# Altium project PuttPilot-Dev.PrjPcb (part 3 of 4)

## Sheet USB_TO_UART.SchDoc: USB to UART
size 279 x 215 mm; DrawnBy: Ethan Abraham; Engineer: Ethan Abraham; Revision: 1.0; SheetNumber: 6; SheetTotal: 7
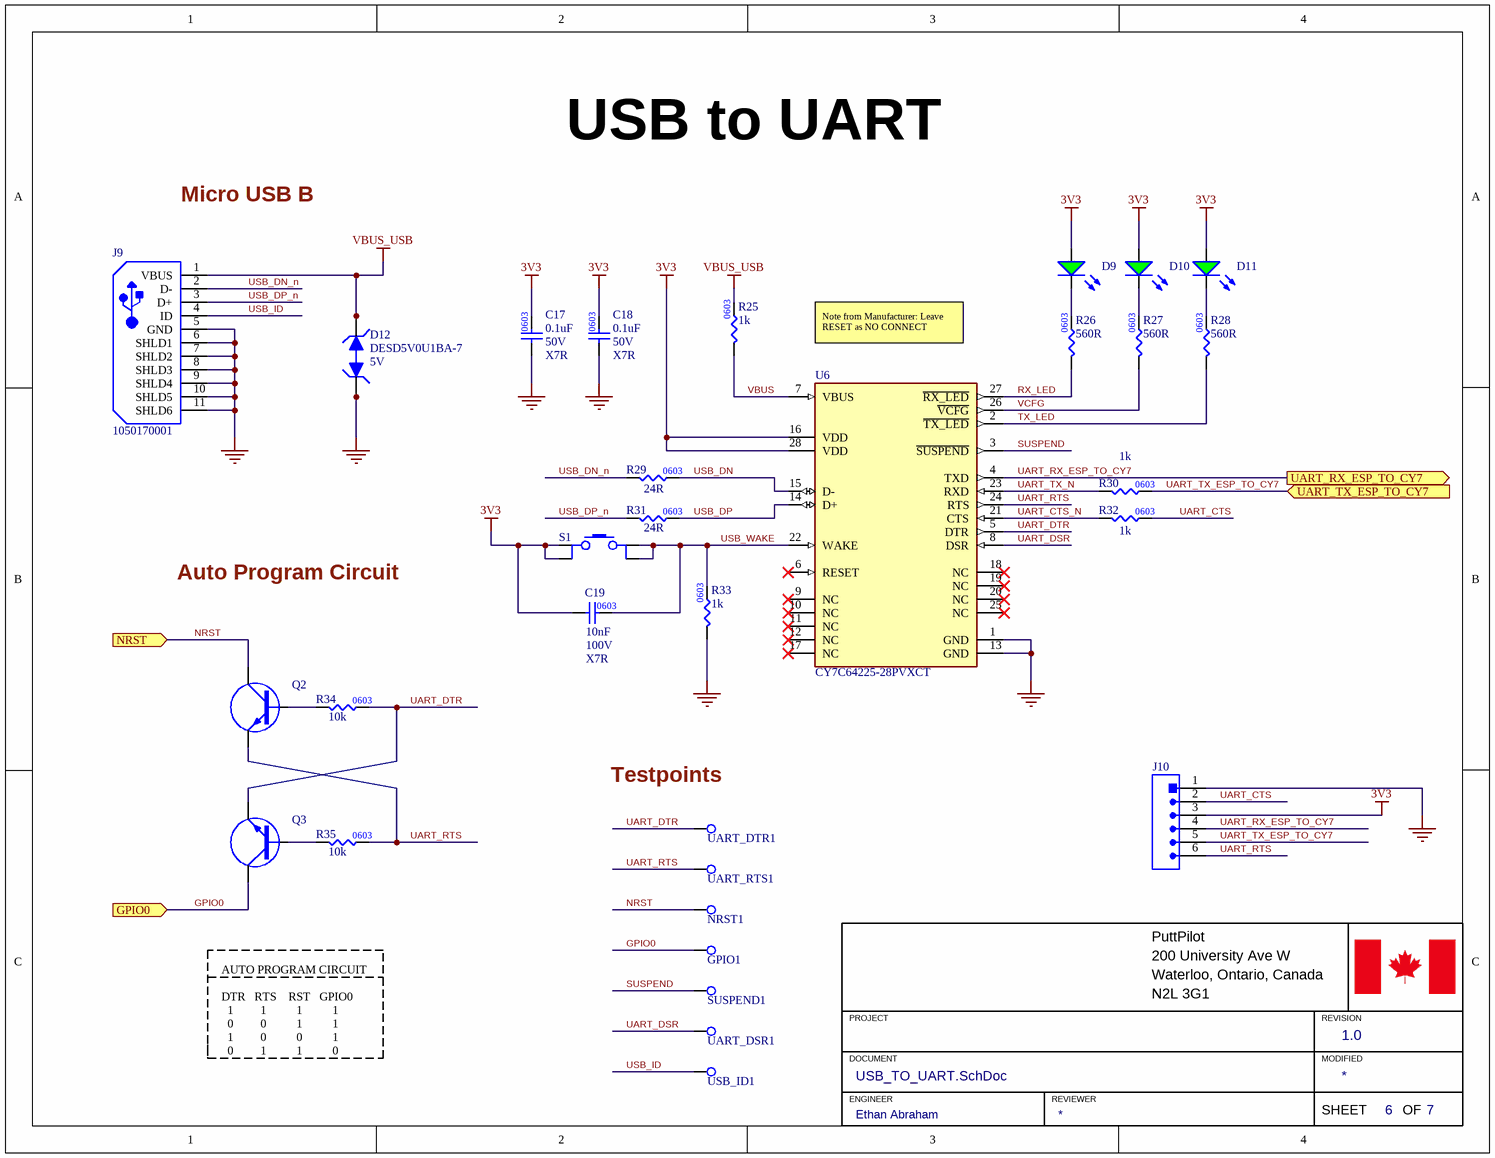
[diagram p5: USB_TO_UART.SchDoc]

### Parts
C17  Temperature Characteristics Code: X7R  Rated DC Voltage (URdc): 50V  Capacitance: 0.1uF  [.CAP_0603]  (hidden comment: GCJ188R71H104KA12D)
C18  Temperature Characteristics Code: X7R  Rated DC Voltage (URdc): 50V  Capacitance: 0.1uF  [.CAP_0603]  (hidden comment: GCJ188R71H104KA12D)
C19  Dielectric: X7R  Voltage Rating: 100V  Capacitance: 10nF  [.CAP_0603]  (hidden comment: GCM188R72A103KA37D)
D9  LTST-C191KGKT  [.LED_0603]  (value not drawn)
D10  LTST-C191KGKT  [.LED_0603]  (value not drawn)
D11  LTST-C191KGKT  [.LED_0603]  (value not drawn)
D12  DESD5V0U1BA-7  Rep Pk Reverse Voltage-Max: 5V  [DESD5V0U1BA-7]
GPIO1  RCWCTE  [RCWCTE]  (value not drawn)
J9  1050170001  [USB_MICRO_B]
J10  PRPC040SAAN-RC_POS6  [HEADER_6POS_2.54MM]  (value not drawn)
NRST1  RCWCTE  [RCWCTE]  (value not drawn)
Q2  MMBT2222A-7-F  [.SOT-23-3]  (value not drawn)
Q3  MMBT2222A-7-F  [.SOT-23-3]  (value not drawn)
R25  Resistance: 1k  [.RES_0603]  (hidden comment: RC0603FR-071KL)
R26  Resistance: 560R  [.RES_0603]  (hidden comment: RC0603FR-07560RL)
R27  Resistance: 560R  [.RES_0603]  (hidden comment: RC0603FR-07560RL)
R28  Resistance: 560R  [.RES_0603]  (hidden comment: RC0603FR-07560RL)
R29  Resistance: 24R  [.RES_0603]  (hidden comment: RC0603FR-0724RL)
R30  Resistance: 1k  [.RES_0603]  (hidden comment: RC0603FR-071KL)
R31  Resistance: 24R  [.RES_0603]  (hidden comment: RC0603FR-0724RL)
R32  Resistance: 1k  [.RES_0603]  (hidden comment: RC0603FR-071KL)
R33  Resistance: 1k  [.RES_0603]  (hidden comment: RC0603FR-071KL)
R34  Resistance: 10k  [.RES_0603]  (hidden comment: RC0603FR-0710KL)
R35  Resistance: 10k  [.RES_0603]  (hidden comment: RC0603FR-0710KL)
S1  PTS647SN38SMTR2LFS  [PTS647SN38SMTR2LFS]  (value not drawn)
SUSPEND1  RCWCTE  [RCWCTE]  (value not drawn)
U6  CY7C64225-28PVXCT  [CY7C64225-28PVXCT]
UART_DSR1  RCWCTE  [RCWCTE]  (value not drawn)
UART_DTR1  RCWCTE  [RCWCTE]  (value not drawn)
UART_RTS1  RCWCTE  [RCWCTE]  (value not drawn)
USB_ID1  RCWCTE  [RCWCTE]  (value not drawn)

### Ports
GPIO0 (in), NRST (in), UART_RX_ESP_TO_CY7 (out), UART_TX_ESP_TO_CY7 (in)

### Nets
3V3: C17.2 C18.2 C19.1 D9.1(A) D10.1(A) D11.1(A) J10.3 S1.1 S1.2 U6.16(VDD) U6.28(VDD)
GND: C17.1 C18.1 D12.1(Pin_1) J9.5(GND) J9.6(SHLD1) J9.7(SHLD2) J9.8(SHLD3) J9.9(SHLD4) J9.10(SHLD5) J9.11(SHLD6) J10.1 R33.1 U6.1(GND) U6.13(GND)
VBUS_USB: D12.2(Pin_2) J9.1(VBUS) R25.2
GPIO0: GPIO1.1 Q3.2(Emitter) ; port GPIO0
NRST: NRST1.1 Q2.2(Emitter) ; port NRST
RX_LED: R26.1 U6.27(~{RX_LED})
SUSPEND: SUSPEND1.1 U6.3(~{SUSPEND})
TX_LED: R28.1 U6.2(~{TX_LED})
UART_CTS: J10.2 R32.2
UART_CTS_N: R32.1 U6.21(CTS)
UART_DSR: U6.8(DSR) UART_DSR1.1
UART_DTR: Q3.3(Collector) R34.2 U6.5(DTR) UART_DTR1.1
UART_RTS: J10.6 Q2.3(Collector) R35.2 U6.24(RTS) UART_RTS1.1
UART_RX_ESP_TO_CY7: J10.4 U6.4(TXD) ; port UART_RX_ESP_TO_CY7
UART_TX_ESP_TO_CY7: J10.5 R30.2 ; port UART_TX_ESP_TO_CY7
UART_TX_N: R30.1 U6.23(RXD)
USB_DN: R29.2 U6.15(D-)
USB_DN_n: J9.2(D-) R29.1
USB_DP: R31.2 U6.14(D+)
USB_DP_n: J9.3(D+) R31.1
USB_ID: J9.4(ID) USB_ID1.1
USB_WAKE: C19.2 R33.2 S1.3 S1.4 U6.22(WAKE)
VBUS: R25.1 U6.7(VBUS)
VCFG: R27.1 U6.26(~{VCFG})
NetD9_2: D9.2(K) R26.2
NetD10_2: D10.2(K) R27.2
NetD11_2: D11.2(K) R28.2
NetQ2_1: Q2.1(Base) R34.1
NetQ3_1: Q3.1(Base) R35.1

Not connected (* = marked no-connect by the designer): U6 6(RESET)* 9(NC)* 10(NC)* 11(NC)* 12(NC)* 17(NC)* 18(NC)* 19(NC)* 20(NC)* 25(NC)*

### Notes on the sheet
- Micro USB B
- Note from Manufacturer: Leave RESET as NO CONNECT
- Auto Program Circuit
- (near UART_DTR1) Testpoints
- AUTO PROGRAM CIRCUIT
  DTR   RTS    RST   GPIO0
  1         1          1          1
  0         0          1          1
  1         0          0          1
  0         1          1          0
- PuttPilot
- 200 University Ave W
- PROJECT
- Waterloo, Ontario, Canada
- N2L 3G1
- REVISION
- DOCUMENT
- ENGINEER
- REVIEWER
- MODIFIED
- SHEET
- OF

### Library data of the parts
C17 C18 = GCJ188R71H104KA12D: CAP CER 0.1uF 50V X7R 0603; Manufacturer: Murata; Dielectric Material: Ceramic; Multilayer: Yes; Negative Tolerance: 10%; Reference Standard: AEC-Q200; Supplier 1: Future Electronics; Manufacturer Part Number: GCJ188R71H104KA12D; RoHS: Yes; Category: Ceramic Capacitors; Stock 1: 3280000; Pricing 1: 4000=0.0182, 12000=0.0178, 20000=0.0176, 80000=0.017, 120000=0.0167 (USD); Mount: Surface Mount; Number of Pins: 2; Package Shape: Rectangular; Size Code: 0603; Terminal Finish: Nickel; Min Operating Temperature: -55°C; Max Operating Temperature: 125°C; JESD-609 Code: e3; Capacitor Type: Ceramic; Package Style: SMTMeter; Packaging: Tape and Reel; Positive Tolerance: 10%; Termination: Wraparound; Length: 1.6mm; Width: 0.8mm; Height: 0.8mm; Reach SVHC Compliant: Yes; RoHS Compliant: Yes; ComponentLink1URL: https://psearch.en.murata.com:443/capacitor/product/GCJ188R71H104KA12%23.pdf?src-supplier=IHS+Markit; ComponentLink1Description: https://psearch.en.murata.com:443/capacitor/product/GCJ188R71H104KA12%23.pdf?src-supplier=IHS+Markit; ComponentLink2URL: https://datasheet.ciiva.com/135/product-135604.pdf?src-supplier=Digikey; ComponentLink2Description: https://datasheet.ciiva.com/135/product-135604.pdf?src-supplier=Digikey; ComponentLink3URL: https://datasheet.ciiva.com/26889/getdatasheetpartid-369886-26889118.pdf?src-supplier=Verical; ComponentLink3Description: https://datasheet.ciiva.com/26889/getdatasheetpartid-369886-26889118.pdf?src-supplier=Verical; ComponentLink4URL: https://datasheet.ciiva.com/135/s0717e-135605.pdf?src-supplier=Digikey; ComponentLink4Description: https://datasheet.ciiva.com/135/s0717e-135605.pdf?src-supplier=Digikey; ComponentLink5URL: https://datasheet.ciiva.com/135/s0717e-135606.pdf?src-supplier=Digikey; ComponentLink5Description: https://datasheet.ciiva.com/135/s0717e-135606.pdf?src-supplier=Digikey; ComponentLink6URL: https://datasheet.ciiva.com/16440/c03e-16440425.pdf?src-supplier=Future+Electronics; ComponentLink6Description: https://datasheet.ciiva.com/16440/c03e-16440425.pdf?src-supplier=Future+Electronics; Supplier Part Number 1: 1158604
C19 = GCM188R72A103KA37D: CAP CER 0.01uF 100V X7R; Manufacturer: Murata; Material: Ceramic; Tolerance: 10%; Supplier 1: Future Electronics; Manufacturer Part Number: GCM188R72A103KA37D; RoHS: Yes; Category: Ceramic Capacitors; Stock 1: 4568000; Pricing 1: 4000=0.0077, 16000=0.0074, 60000=0.0071, 100000=0.007, 200000=0.0068 (USD); Mount: Surface Mount; Case/Package: 0603; Case Code (Imperial): 0603; Case Code (Metric): 1608; Min Operating Temperature: -55°C; Max Operating Temperature: 125°C; Packaging: Tape and Reel; Voltage Rating (DC): 100V; Package Quantity: 1; Termination: SMD/SMT; Voltage: 100V; Series: GCM; Construction: Flat; Length: 1.6mm; Width: 0.031inch; Height: 0.8mm; Thickness: 0.035inch; Depth: 0.8mm; Ratings: AEC-Q200; Radiation Hardening: No; Reach SVHC Compliant: No; Lead Free: Lead Free; RoHS Compliant: Yes; ComponentLink1URL: https://datasheet.ciiva.com/132/product-132907.pdf?src-supplier=Digikey; ComponentLink1Description: https://datasheet.ciiva.com/132/product-132907.pdf?src-supplier=Digikey; ComponentLink2URL: https://datasheet.ciiva.com/132/product-132908.pdf?src-supplier=Digikey; ComponentLink2Description: https://datasheet.ciiva.com/132/product-132908.pdf?src-supplier=Digikey; ComponentLink3URL: https://datasheet.ciiva.com/132/product-132909.pdf?src-supplier=Digikey; ComponentLink3Description: https://datasheet.ciiva.com/132/product-132909.pdf?src-supplier=Digikey; ComponentLink4URL: https://datasheet.ciiva.com/16497/product-16497251.pdf?src-supplier=Future+Electronics; ComponentLink4Description: https://datasheet.ciiva.com/16497/product-16497251.pdf?src-supplier=Future+Electronics; ComponentLink5URL: https://datasheet.ciiva.com/18183/getdatasheetpartid-178890-18183651.pdf?src-supplier=Verical; ComponentLink5Description: https://datasheet.ciiva.com/18183/getdatasheetpartid-178890-18183651.pdf?src-supplier=Verical; ComponentLink6URL: https://datasheet.ciiva.com/11786/0900766b80ef92d0-11786108.pdf?src-supplier=Rs; ComponentLink6Description: https://datasheet.ciiva.com/11786/0900766b80ef92d0-11786108.pdf?src-supplier=Rs; ComponentLink7URL: https://datasheet.ciiva.com/11619/product-11619719.pdf?src-supplier=Avnet; ComponentLink7Description: https://datasheet.ciiva.com/11619/product-11619719.pdf?src-supplier=Avnet; Supplier Part Number 1: 5029232
D9-D11 = LTST-C191KGKT: LED GREEN 2V 0603; Manufacturer: Vishay Lite-On; Shape: Rectangular; Lens Style: WATER CLEAR; Forward Current-Max: 30mA; Luminous Intensity-Nom: 35mcd; Number of Functions: 1; Optoelectronic Device Type: SINGLE COLOR LED; Viewing Angle: 130°; Forward Voltage-Max: 2.4V; Reverse Voltage-Max: 5V; Overall Height: 0.55mm; Supplier 1: Digikey; Manufacturer Part Number: LTST-C191KGKT; RoHS: Yes; Stock 1: 171853; Pricing 1: 1=0.22, 10=0.121, 100=0.0721, 500=0.05324, 1000=0.04748, 2000=0.04278 (USD); Mount: Surface Mount; Number of Pins: 2; Color: Green; Color@wavelength: Green; Terminal Finish: Tin; Min Operating Temperature: -55°C; Max Operating Temperature: 85°C; Packaging: Tape and Reel; JESD-609 Code: e3; Size: 1.1mm; Terminal Pitch: 1.5mm; Reach SVHC Compliant: Yes; RoHS Compliant: Yes; ComponentLink1URL: https://datasheet.ciiva.com:443/pdfs/VipMasterIC/IC/LITE/LITE-S-A0003156116/LITE-S-A0003156116-1.pdf?src-supplier=IHS+Markit; ComponentLink1Description: https://datasheet.ciiva.com:443/pdfs/VipMasterIC/IC/LITE/LITE-S-A0003156116/LITE-S-A0003156116-1.pdf?src-supplier=IHS+Markit; ComponentLink2URL: https://datasheet.ciiva.com/2109/ltst-c191kgkt-2109973.pdf?src-supplier=Digikey; ComponentLink2Description: https://datasheet.ciiva.com/2109/ltst-c191kgkt-2109973.pdf?src-supplier=Digikey; Supplier Part Number 1: 160-1446-1-ND
D12 = DESD5V0U1BA-7: TVS DIODE 5VWM; Manufacturer: Diodes; Diode Element Material: SILICON; Package Body Material: Plastic; Polarity: Bidirectional; Max Breakdown Voltage: 9.5V; Min Breakdown Voltage: 5.5V; Diode Type: TRANS VOLTAGE SUPPRESSOR; Number of Elements: 1; Max Power Dissipation: 250mW; Reference Standard: IEC-61000-4-2; Supplier 1: Future Electronics; Manufacturer Part Number: DESD5V0U1BA-7; RoHS: Yes; Category: TVS Diodes; Stock 1: 54000; Pricing 1: 3000=0.0283, 12000=0.0271, 30000=0.0263, 75000=0.0256, 120000=0.0244 (USD); Number of Pins: 2; Package Shape: Rectangular; Min Operating Temperature: -65°C; Max Operating Temperature: 150°C; JESD-30 Code: R-PDSO-G2; Package Style: SMALL OUTLINEMeter; Surface Mount: Yes; Technology: AVALANCHE; Terminal Form: Gull Wing; Terminal Position: DUAL; Reach SVHC Compliant: Yes; RoHS Compliant: Yes; ComponentLink1URL: https://datasheet.ciiva.com:443/pdfs/VipMasterIC/IC/DIOD/DIOD-S-A0002833665/DIOD-S-A0002833261-1.pdf?src-supplier=IHS+Markit; ComponentLink1Description: https://datasheet.ciiva.com:443/pdfs/VipMasterIC/IC/DIOD/DIOD-S-A0002833665/DIOD-S-A0002833261-1.pdf?src-supplier=IHS+Markit; ComponentLink2URL: http://www.farnell.com/datasheets/2814368.pdf?src-supplier=Farnell; ComponentLink2Description: http://www.farnell.com/datasheets/2814368.pdf?src-supplier=Farnell; ComponentLink3URL: http://www.mouser.com/ds/2/115/DESD5V0U1BA-756900.pdf?src-supplier=Mouser; ComponentLink3Description: http://www.mouser.com/ds/2/115/DESD5V0U1BA-756900.pdf?src-supplier=Mouser; ComponentLink4URL: http://www.farnell.com/datasheets/2814368.pdf?src-supplier=Element14; ComponentLink4Description: http://www.farnell.com/datasheets/2814368.pdf?src-supplier=Element14; ComponentLink5URL: http://www.farnell.com/datasheets/2814368.pdf?src-supplier=Newark; ComponentLink5Description: http://www.farnell.com/datasheets/2814368.pdf?src-supplier=Newark; ComponentLink6URL: https://www.diodes.com/assets/Datasheets/DESD5V0U1BA.pdf?src-supplier=Digikey; ComponentLink6Description: https://www.diodes.com/assets/Datasheets/DESD5V0U1BA.pdf?src-supplier=Digikey; Supplier Part Number 1: 8076210
GPIO1 NRST1 SUSPEND1 UART_DSR1 UART_DTR1 UART_RTS1 USB_ID1 = RCWCTE: SMT Test Point; Manufacturer: KOA Speer; Resistance: 0R; Current Rating: 2A; Number of Contacts: 1; Supplier 1: Digikey; Manufacturer Part Number: RCWCTE; RoHS: Yes; Category: Chip SMD Resistors; Stock 1: 56953; Pricing 1: 1=0.2, 10=0.15, 25=0.1344, 50=0.1238, 100=0.1141, 250=0.10268, 500=0.09488, 1000=0.08781 (USD); Mount: Surface Mount; Case/Package: 1206; Case Code (Imperial): 1206; Case Code (Metric): 3216; Contact Material: Copper,Tin; Min Operating Temperature: -55°C; Max Operating Temperature: 125°C; Packaging: Tape and Reel; Termination: SMD/SMT; Series: RC; Length: 3.2mm; Width: 1.6mm; Height: 2mm; Depth: 1.6mm; Military Standard: Not; RoHS Compliant: Yes; ComponentLink1URL: https://datasheet.ciiva.com/34302/1876186-34302940.pdf?src-supplier=Jameco; ComponentLink1Description: https://datasheet.ciiva.com/34302/1876186-34302940.pdf?src-supplier=Jameco; ComponentLink2URL: https://datasheet.ciiva.com/5556/rc-5556236.pdf?src-supplier=Mouser; ComponentLink2Description: https://datasheet.ciiva.com/5556/rc-5556236.pdf?src-supplier=Mouser; ComponentLink3URL: https://datasheet.ciiva.com/26821/getdatasheetpartid-110197-26821157.pdf?src-supplier=Verical; ComponentLink3Description: https://datasheet.ciiva.com/26821/getdatasheetpartid-110197-26821157.pdf?src-supplier=Verical; Supplier Part Number 1: 2019-RCWCTECT-ND
J9 = 1050170001: CONN USB MICRO B R/A; Manufacturer: Molex; Connector Type: TELECOM AND DATACOM CONNECTOR; Option: General Purpose; Additional Feature: Shielded; Board Mounting Option: PEG; Body/Shell Style: RECEPTACLE; Contact Resistance: 30mR; Dielectric Withstanding Voltage (AC): 100V; Durability: 10000Cycles; Empty Shell: No; Insulation Resistance: 1GR; Number Of Connectors: 1; PCB Contact Pattern: RECTANGULAR; Polarization Key: POLARIZED HOUSING; Rated Current (Signal): 1.8A; Number of Contacts: 5; Body Breadth: 0.114inch; Body Depth: 0.213inch; Body Length: 0.315inch; Mounting Option 1: DETENT; Mounting Option 2: LOCKING; Reference Standard: UL; Reliability: COMMERCIAL; Supplier 1: Avnet; Manufacturer Part Number: 1050170001; RoHS: Yes; Category: USB Connectors; Stock 1: 6195; Pricing 1: 1=1.14, 25=0.962, 100=0.813, 250=0.812, 1000=0.663 (USD); Mount: Cable; Contact Material: Copper Alloy; Contact Finish - Mating: GOLD; Contact Finish - Termination: Gold (Au) - with Nickel (Ni) barrier; Insulation Material: Polymer; Shell Finish: Tin; Shell Material: Stainless Steel; Min Operating Temperature: -30°C; Max Operating Temperature: 85°C; JESD-609 Code: e4; Contact Gender: Female; Contact Style: USB; Filter Feature: No; Mixed Contacts: No; Mounting Style: RIGHT ANGLE; Number Of PCB Rows: 1; Termination: SMD/SMT; Terminal Pitch: 0.635mm; Reach SVHC Compliant: Yes; RoHS Compliant: Yes; DIN Conformance: No; IEC Conformance: No; MIL Conformance: No; ComponentLink1URL: https://datasheet.ciiva.com:443/pdfs/VipMasterIC/IC/MOLE/MOLE-S-A0006795785/MOLE-S-A0006864883-1.pdf?src-supplier=IHS+Markit; ComponentLink1Description: https://datasheet.ciiva.com:443/pdfs/VipMasterIC/IC/MOLE/MOLE-S-A0006795785/MOLE-S-A0006864883-1.pdf?src-supplier=IHS+Markit; ComponentLink2URL: https://datasheet.ciiva.com/30165/235271050170001-io-nectors-30165183.pdf?src-supplier=Onlinecomponents.com; ComponentLink2Description: https://datasheet.ciiva.com/30165/235271050170001-io-nectors-30165183.pdf?src-supplier=Onlinecomponents.com; ComponentLink3URL: https://datasheet.ciiva.com/5742/1598502-5742508.pdf?src-supplier=Farnell; ComponentLink3Description: https://datasheet.ciiva.com/5742/1598502-5742508.pdf?src-supplier=Farnell; Supplier Part Number 1: 78R1699
J10 = PRPC040SAAN-RC_POS6: CONN HEADER VERT 6POS 2.54MM
Q2 Q3 = MMBT2222A-7-F: NPN BJT 40V 600mA SOT-23; Manufacturer: Diodes; Package Body Material: Plastic; Transistor Element Material: SILICON; Additional Feature: HIGH RELIABILITY; DC Current Gain-Min (hFE): 40; Number of Elements: 1; Power Dissipation-Max (Abs): 300mW; Time @ Peak Reflow Temperature-Max (s): 40s; Transistor Application: SWITCHING; Transition Frequency-Nom (fT): 300MHz; Turn-off Time-Max (toff): 285ns; Turn-on Time-Max (ton): 35ns; Reference Standard: AEC-Q101; Qualification Status: Not Qualified; Supplier 1: Future Electronics; Manufacturer Part Number: MMBT2222A-7-F; RoHS: Yes; Category: BJTs; Stock 1: 6903000; Pricing 1: 3000=0.013, 12000=0.0124, 30000=0.0121, 75000=0.0117, 120000=0.0112 (USD); Number of Pins: 3; Package Shape: Rectangular; Terminal Finish: Tin; Max Operating Temperature: 150°C; JESD-609 Code: e3; Polarity/Channel Type: NPN; Max Collector Current: 600mA; Collector-emitter Voltage-Max: 40V; JESD-30 Code: R-PDSO-G3; Moisture Sensitivity Level: 1; Package Style: SMALL OUTLINEMeter; Peak Reflow Temperature (Cel): 260°C; Surface Mount: Yes; Terminal Form: Gull Wing; Terminal Position: DUAL; Reach SVHC Compliant: Yes; RoHS Compliant: Yes; ComponentLink1URL: https://datasheet.ciiva.com:443/pdfs/VipMasterIC/IC/DIOD/DIOD-S-A0001811952/DIOD-S-A0001811952-1.pdf?src-supplier=IHS+Markit; ComponentLink1Description: https://datasheet.ciiva.com:443/pdfs/VipMasterIC/IC/DIOD/DIOD-S-A0001811952/DIOD-S-A0001811952-1.pdf?src-supplier=IHS+Markit; ComponentLink2URL: https://datasheet.ciiva.com/15139/getdatasheetpartid-82692-15139078.pdf?src-supplier=Verical; ComponentLink2Description: https://datasheet.ciiva.com/15139/getdatasheetpartid-82692-15139078.pdf?src-supplier=Verical; ComponentLink3URL: https://datasheet.ciiva.com/11198/ds30041-11198965.pdf?src-supplier=Avnet; ComponentLink3Description: https://datasheet.ciiva.com/11198/ds30041-11198965.pdf?src-supplier=Avnet; ComponentLink4URL: https://datasheet.ciiva.com/11201/ds30041-11201864.pdf?src-supplier=Avnet; ComponentLink4Description: https://datasheet.ciiva.com/11201/ds30041-11201864.pdf?src-supplier=Avnet; ComponentLink5URL: https://datasheet.ciiva.com/972/ds30041-972550.pdf?src-supplier=Digikey; ComponentLink5Description: https://datasheet.ciiva.com/972/ds30041-972550.pdf?src-supplier=Digikey; ComponentLink6URL: https://datasheet.ciiva.com/972/ds30041-972551.pdf?src-supplier=Digikey; ComponentLink6Description: https://datasheet.ciiva.com/972/ds30041-972551.pdf?src-supplier=Digikey; ComponentLink7URL: https://datasheet.ciiva.com/972/ds30041-972552.pdf?src-supplier=Digikey; ComponentLink7Description: https://datasheet.ciiva.com/972/ds30041-972552.pdf?src-supplier=Digikey; ComponentLink8URL: https://datasheet.ciiva.com/16199/ds30041-16199045.pdf?src-supplier=Future+Electronics; ComponentLink8Description: https://datasheet.ciiva.com/16199/ds30041-16199045.pdf?src-supplier=Future+Electronics; ComponentLink9URL: https://datasheet.ciiva.com/8029/ds30041-8029709.pdf?src-supplier=Element14; ComponentLink9Description: https://datasheet.ciiva.com/8029/ds30041-8029709.pdf?src-supplier=Element14; Supplier Part Number 1: 4135070
R25 R30 R32 R33 = RC0603FR-071KL: RES 1K OHM 0603; Manufacturer: Yageo; Tolerance: 1%; Additional Feature: LASER TRIMMABLE; Rated Power Dissipation (P): 100mW; Rated Temperature: 70°C; Temperature Coefficient: 100ppm/°C; Working Voltage: 75V; Package Height: 0.45mm; Package Length: 1.6mm; Package Width: 0.8mm; Supplier 1: Future Electronics; Manufacturer Part Number: RC0603FR-071KL; RoHS: Yes; Category: Chip SMD Resistors; Stock 1: 12810000; Pricing 1: 5000=0.0026, 50000=0.0025, 150000=0.0024, 375000=0.0023, 1000000=0.0022 (USD); Mount: Surface Mount; Number of Pins: 2; Package Shape: Rectangular; Size Code: 0603; Terminal Finish: Nickel; Min Operating Temperature: -55°C; Max Operating Temperature: 155°C; JESD-609 Code: e3; Resistor Type: FIXED RESISTOR; Construction: Chip; Package Style: SMTMeter; Packaging: Tape and Reel; Technology: METAL GLAZE/THICK FILM; Termination: Wraparound; Reach SVHC Compliant: Yes; RoHS Compliant: Yes; ComponentLink1URL: https://datasheet.ciiva.com:443/pdfs/VipMasterIC/IC/YAGO/YAGO-S-A0008145938/YAGO-S-A0008145938-1.pdf?src-supplier=IHS+Markit; ComponentLink1Description: https://datasheet.ciiva.com:443/pdfs/VipMasterIC/IC/YAGO/YAGO-S-A0008145938/YAGO-S-A0008145938-1.pdf?src-supplier=IHS+Markit; ComponentLink2URL: https://datasheet.ciiva.com/11808/0900766b80f96399-11808081.pdf?src-supplier=Rs; ComponentLink2Description: https://datasheet.ciiva.com/11808/0900766b80f96399-11808081.pdf?src-supplier=Rs; ComponentLink3URL: https://datasheet.ciiva.com/8896/pyu-rc0603-51-rohs-l-4-8896106.pdf?src-supplier=Avnet; ComponentLink3Description: https://datasheet.ciiva.com/8896/pyu-rc0603-51-rohs-l-4-8896106.pdf?src-supplier=Avnet; ComponentLink4URL: https://datasheet.ciiva.com/7660/1868787-7660790.pdf?src-supplier=Element14; ComponentLink4Description: https://datasheet.ciiva.com/7660/1868787-7660790.pdf?src-supplier=Element14; ComponentLink5URL: https://datasheet.ciiva.com/7746/1738695-7746279.pdf?src-supplier=Element14; ComponentLink5Description: https://datasheet.ciiva.com/7746/1738695-7746279.pdf?src-supplier=Element14; ComponentLink6URL: https://datasheet.ciiva.com/7746/1686128-7746280.pdf?src-supplier=Element14; ComponentLink6Description: https://datasheet.ciiva.com/7746/1686128-7746280.pdf?src-supplier=Element14; ComponentLink7URL: https://datasheet.ciiva.com/7746/1738695-7746281.pdf?src-supplier=Element14; ComponentLink7Description: https://datasheet.ciiva.com/7746/1738695-7746281.pdf?src-supplier=Element14; ComponentLink8URL: https://datasheet.ciiva.com/7983/443971-7983613.pdf?src-supplier=Element14; ComponentLink8Description: https://datasheet.ciiva.com/7983/443971-7983613.pdf?src-supplier=Element14; ComponentLink9URL: https://datasheet.ciiva.com/15189/getdatasheetpartid-404327-15189644.pdf?src-supplier=Verical; ComponentLink9Description: https://datasheet.ciiva.com/15189/getdatasheetpartid-404327-15189644.pdf?src-supplier=Verical; Supplier Part Number 1: 4016291
R26-R28 = RC0603FR-07560RL: RES 560 OHM 0603; Manufacturer: Yageo; Tolerance: 1%; Voltage Rating (DC): 50V; Temperature Coefficient: 100ppm/°C; Power Rating: 100mW; Voltage Rating: 75V; Supplier 1: Future Electronics; Manufacturer Part Number: RC0603FR-07560RL; RoHS: Yes; Category: Chip SMD Resistors; Stock 1: 185000; Pricing 1: 5000=0.002, 50000=0.0019, 150000=0.0019, 375000=0.0018, 1000000=0.0017 (USD); Case/Package: 0603; Number of Pins: 2; Case Code (Imperial): 0603; Case Code (Metric): 1608; Weight: 7.1E-05oz; Min Operating Temperature: -55°C; Max Operating Temperature: 155°C; Packaging: Tape and Reel; Resistor Type: Thick Film; Package Quantity: 1; Termination: SMD/SMT; Number of Terminations: 2; Max Power Dissipation: 100mW; Features: Moisture Resistant; Series: RC; Construction: Rectangular; Resistance Tolerance: 1%; Technology: THICK FILM; Voltage Rating (AC): 50V; Length: 1.6mm; Width: 0.8mm; Height: 0.45mm; Depth: 0.8mm; Reach SVHC Compliant: No; Lead Free: Lead Free; Military Standard: Not; RoHS Compliant: Yes; ComponentLink1URL: https://datasheet.ciiva.com/11808/0900766b80f96399-11808127.pdf?src-supplier=Rs; ComponentLink1Description: https://datasheet.ciiva.com/11808/0900766b80f96399-11808127.pdf?src-supplier=Rs; ComponentLink2URL: https://datasheet.ciiva.com/2454/pyu-r-int-thick-7-2454381.pdf?src-supplier=Digikey; ComponentLink2Description: https://datasheet.ciiva.com/2454/pyu-r-int-thick-7-2454381.pdf?src-supplier=Digikey; ComponentLink3URL: https://datasheet.ciiva.com/2454/pyu-r-int-thick-7-2454382.pdf?src-supplier=Digikey; ComponentLink3Description: https://datasheet.ciiva.com/2454/pyu-r-int-thick-7-2454382.pdf?src-supplier=Digikey; ComponentLink4URL: https://datasheet.ciiva.com/2454/pyu-r-int-thick-7-2454383.pdf?src-supplier=Digikey; ComponentLink4Description: https://datasheet.ciiva.com/2454/pyu-r-int-thick-7-2454383.pdf?src-supplier=Digikey; ComponentLink5URL: https://datasheet.ciiva.com/7746/443971-7746374.pdf?src-supplier=Element14; ComponentLink5Description: https://datasheet.ciiva.com/7746/443971-7746374.pdf?src-supplier=Element14; ComponentLink6URL: https://datasheet.ciiva.com/7746/443971-7746375.pdf?src-supplier=Element14; ComponentLink6Description: https://datasheet.ciiva.com/7746/443971-7746375.pdf?src-supplier=Element14; ComponentLink7URL: https://datasheet.ciiva.com/46412/443971-46412853.pdf?src-supplier=Element14; ComponentLink7Description: https://datasheet.ciiva.com/46412/443971-46412853.pdf?src-supplier=Element14; Supplier Part Number 1: 3410891
R29 R31 = RC0603FR-0724RL: RES 24 OHM 0603; Manufacturer: Yageo; Tolerance: 1%; Additional Feature: LASER TRIMMABLE; Rated Power Dissipation (P): 100mW; Rated Temperature: 70°C; Temperature Coefficient: 100ppm/°C; Working Voltage: 75V; Package Height: 0.45mm; Package Length: 1.6mm; Package Width: 0.8mm; Supplier 1: Future Electronics; Manufacturer Part Number: RC0603FR-0724RL; RoHS: Yes; Category: Chip SMD Resistors; Stock 1: 25000; Pricing 1: 5000=0.0021, 50000=0.002, 150000=0.002, 375000=0.0019, 1000000=0.0018 (USD); Mount: Surface Mount; Number of Pins: 2; Package Shape: Rectangular; Size Code: 0603; Terminal Finish: Nickel; Min Operating Temperature: -55°C; Max Operating Temperature: 155°C; JESD-609 Code: e3; Resistor Type: FIXED RESISTOR; Construction: Chip; Package Style: SMTMeter; Packaging: Tape and Reel; Technology: METAL GLAZE/THICK FILM; Termination: Wraparound; Reach SVHC Compliant: Yes; RoHS Compliant: Yes; ComponentLink1URL: https://datasheet.ciiva.com:443/pdfs/VipMasterIC/IC/YAGO/YAGO-S-A0008145938/YAGO-S-A0008145938-1.pdf?src-supplier=IHS+Markit; ComponentLink1Description: https://datasheet.ciiva.com:443/pdfs/VipMasterIC/IC/YAGO/YAGO-S-A0008145938/YAGO-S-A0008145938-1.pdf?src-supplier=IHS+Markit; ComponentLink2URL: http://www.mouser.com/ds/2/447/RC0603-272842.pdf?src-supplier=Mouser; ComponentLink2Description: http://www.mouser.com/ds/2/447/RC0603-272842.pdf?src-supplier=Mouser; ComponentLink3URL: http://www.yageo.com/documents/recent/PYu-RC_Group_51_RoHS_L_9.pdf?src-supplier=Digikey; ComponentLink3Description: http://www.yageo.com/documents/recent/PYu-RC_Group_51_RoHS_L_9.pdf?src-supplier=Digikey; ComponentLink4URL: http://www.yageo.com/documents/recent/PYu-RC_Group_51_RoHS_L_10.pdf?src-supplier=Digikey; ComponentLink4Description: http://www.yageo.com/documents/recent/PYu-RC_Group_51_RoHS_L_10.pdf?src-supplier=Digikey; ComponentLink5URL: https://datasheet.octopart.com/RC0603FR-0724RL-Yageo-datasheet-164759695.pdf?src-supplier=Future+Electronics; ComponentLink5Description: https://datasheet.octopart.com/RC0603FR-0724RL-Yageo-datasheet-164759695.pdf?src-supplier=Future+Electronics; Supplier Part Number 1: 7556541
R34 R35 = RC0603FR-0710KL: RES 10K OHM 0603; Manufacturer: Yageo; Tolerance: 1%; Additional Feature: LASER TRIMMABLE; Rated Power Dissipation (P): 100mW; Rated Temperature: 70°C; Temperature Coefficient: 100ppm/°C; Working Voltage: 75V; Package Height: 0.45mm; Package Length: 1.6mm; Package Width: 0.8mm; Supplier 1: Future Electronics; Manufacturer Part Number: RC0603FR-0710KL; RoHS: Yes; Category: Chip SMD Resistors; Stock 1: 30355000; Pricing 1: 5000=0.0026, 50000=0.0025, 150000=0.0024, 375000=0.0023, 1000000=0.0022 (USD); Mount: Surface Mount; Number of Pins: 2; Package Shape: Rectangular; Size Code: 0603; Terminal Finish: Nickel; Min Operating Temperature: -55°C; Max Operating Temperature: 155°C; JESD-609 Code: e3; Resistor Type: FIXED RESISTOR; Construction: Chip; Package Style: SMTMeter; Packaging: Tape and Reel; Technology: METAL GLAZE/THICK FILM; Termination: Wraparound; Reach SVHC Compliant: Yes; RoHS Compliant: Yes; ComponentLink1URL: https://datasheet.ciiva.com:443/pdfs/VipMasterIC/IC/YAGO/YAGO-S-A0008145938/YAGO-S-A0008145938-1.pdf?src-supplier=IHS+Markit; ComponentLink1Description: https://datasheet.ciiva.com:443/pdfs/VipMasterIC/IC/YAGO/YAGO-S-A0008145938/YAGO-S-A0008145938-1.pdf?src-supplier=IHS+Markit; ComponentLink2URL: https://datasheet.ciiva.com/22747/443971-22747519.pdf?src-supplier=Element14; ComponentLink2Description: https://datasheet.ciiva.com/22747/443971-22747519.pdf?src-supplier=Element14; ComponentLink3URL: https://datasheet.ciiva.com/46440/1868787-46440891.pdf?src-supplier=Element14; ComponentLink3Description: https://datasheet.ciiva.com/46440/1868787-46440891.pdf?src-supplier=Element14; ComponentLink4URL: https://datasheet.ciiva.com/15189/getdatasheetpartid-409289-15189591.pdf?src-supplier=Verical; ComponentLink4Description: https://datasheet.ciiva.com/15189/getdatasheetpartid-409289-15189591.pdf?src-supplier=Verical; ComponentLink5URL: https://datasheet.ciiva.com/7660/38590-7660789.pdf?src-supplier=Element14; ComponentLink5Description: https://datasheet.ciiva.com/7660/38590-7660789.pdf?src-supplier=Element14; ComponentLink6URL: https://datasheet.ciiva.com/7746/1738695-7746239.pdf?src-supplier=Element14; ComponentLink6Description: https://datasheet.ciiva.com/7746/1738695-7746239.pdf?src-supplier=Element14; ComponentLink7URL: https://datasheet.ciiva.com/7983/443971-7983596.pdf?src-supplier=Element14; ComponentLink7Description: https://datasheet.ciiva.com/7983/443971-7983596.pdf?src-supplier=Element14; Supplier Part Number 1: 4023214
S1 = PTS647SN38SMTR2LFS: SWITCH TACTILE SPST-NO 0.05A 12V; Manufacturer: ITT C&K; Supplier 1: Digikey; Manufacturer Part Number: PTS647SN38SMTR2LFS; RoHS: No; Stock 1: 23499; Pricing 1: 1=0.26, 10=0.249, 25=0.236, 100=0.2138, 250=0.19488, 500=0.18114, 1000=0.15453 (USD); RoHS Compliant: Yes; ComponentLink1URL: https://www.ckswitches.com/media/2567/pts647.pdf?src-supplier=Digikey; ComponentLink1Description: https://www.ckswitches.com/media/2567/pts647.pdf?src-supplier=Digikey; ComponentLink2URL: https://datasheet.octopart.com/PTS647SN38SMTR2LFS-C%26K-Components-datasheet-117317067.pdf?src-supplier=Future+Electronics; ComponentLink2Description: https://datasheet.octopart.com/PTS647SN38SMTR2LFS-C%26K-Components-datasheet-117317067.pdf?src-supplier=Future+Electronics; ComponentLink3URL: https://datasheet.octopart.com/PTS647SN38SMTR2LFS-C%26K-Components-datasheet-156105943.pdf?src-supplier=TME; ComponentLink3Description: https://datasheet.octopart.com/PTS647SN38SMTR2LFS-C%26K-Components-datasheet-156105943.pdf?src-supplier=TME; Supplier Part Number 1: PTS647SN38SMTR2LFSCT-ND
U6 = CY7C64225-28PVXCT: USB to UART SOP 28 Pin; Manufacturer: Infineon; Supplier 1: Mouser; Manufacturer Part Number: CY7C64225-28PVXCT; RoHS: No; Stock 1: 2089; Pricing 1: 1=3.8, 10=3.23, 50=3.23, 100=2.8, 1000=2, 10000=1.9 (USD); ComponentLink1URL: https://datasheet.octopart.com/CY7C64225-28PVXCT-Infineon-datasheet-176345636.pdf?src-supplier=Future+Electronics; ComponentLink1Description: https://datasheet.octopart.com/CY7C64225-28PVXCT-Infineon-datasheet-176345636.pdf?src-supplier=Future+Electronics; Supplier Part Number 1: 727-CY7C6422528PVXCT